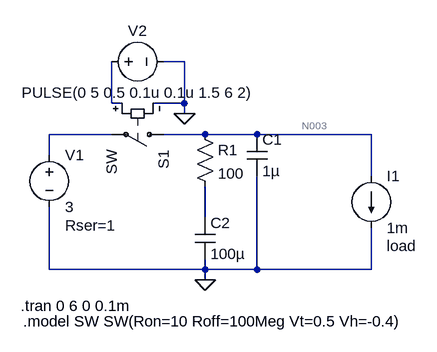
[diagram p0: schematic supply_exp.asc]
supply_exp.asc, the LTspice schematic file:
Version 4
SHEET 1 880 680
WIRE 336 -64 304 -64
WIRE 224 0 224 -64
WIRE 240 0 224 0
WIRE 336 0 336 -64
WIRE 336 0 288 0
WIRE 336 16 336 0
WIRE 224 48 128 48
WIRE 368 48 304 48
WIRE 448 48 368 48
WIRE 624 48 448 48
WIRE 128 80 128 48
WIRE 624 112 624 48
WIRE 368 176 368 128
WIRE 128 256 128 160
WIRE 368 256 368 240
WIRE 368 256 128 256
WIRE 448 256 448 112
WIRE 448 256 368 256
WIRE 624 256 624 192
WIRE 624 256 448 256
WIRE 368 272 368 256
FLAG 368 272 0
FLAG 336 16 0
SYMBOL voltage 128 64 R0
WINDOW 123 0 0 Left 2
WINDOW 39 24 124 Left 2
SYMATTR InstName V1
SYMATTR Value 3
SYMATTR SpiceLine Rser=1
SYMBOL sw 320 48 R90
SYMATTR InstName S1
SYMBOL res 352 32 R0
SYMATTR InstName R1
SYMATTR Value 100
SYMBOL cap 432 48 R0
SYMATTR InstName C1
SYMATTR Value 1µ
SYMBOL cap 352 176 R0
SYMATTR InstName C2
SYMATTR Value 100µ
SYMBOL voltage 208 -64 R270
WINDOW 0 32 56 VTop 2
WINDOW 3 -32 56 VBottom 2
WINDOW 123 0 0 Left 2
WINDOW 39 0 0 Left 2
SYMATTR InstName V2
SYMATTR Value PULSE(0 5 0.5 0.1u 0.1u 1.5 6 2)
SYMBOL current 624 112 R0
WINDOW 123 0 0 Left 2
WINDOW 39 24 108 Left 2
SYMATTR InstName I1
SYMATTR Value 1m
SYMATTR SpiceLine load
TEXT 84 312 Left 2 !.tran 0 6 0 0.1m
TEXT 88 336 Left 2 !.model SW SW(Ron=10 Roff=100Meg Vt=0.5 Vh=-0.4)

The netlist it stands for:
* supply_exp.asc
V1 N002 0 3 Rser=1
S1 N003 N002 N001 0 SW
R1 N003 N004 100
C1 N003 0 1µ
C2 N004 0 100µ
V2 N001 0 PULSE(0 5 0.5 0.1u 0.1u 1.5 6 2)
I1 N003 0 1m load
.tran 0 6 0 0.1m
.model SW SW(Ron=10 Roff=100Meg Vt=0.5 Vh=-0.4)
.backanno
.end

* Results of the author's LTspice run, read from the files saved beside the schematic
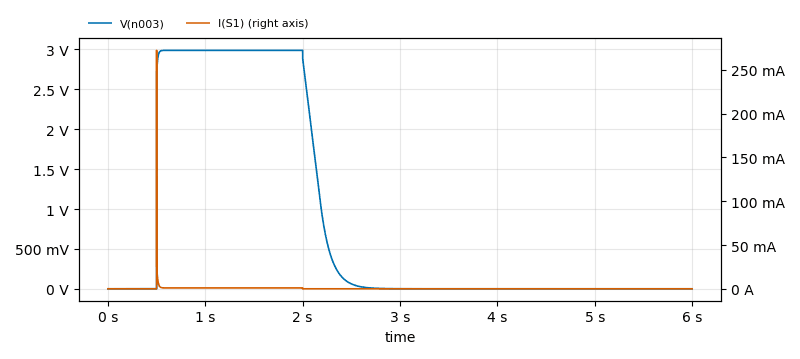
[diagram p1: Transient Analysis of supply_exp.asc, plotted from the saved traces]
* Transient Analysis, 1 run:
*   V(n003): min 30 µV, max 2.989 V, average 827.2 mV, rms 1.539 V, last 30 µV
*   I(S1): min 0 A, max 272.4 mA, average 300.7 µA, rms 1.054 mA, last 30 nA